# Altium schematic sheet Main_NTC_Extension_5fach.SchDoc
size A4; SheetNumber: 1; SheetTotal: 1
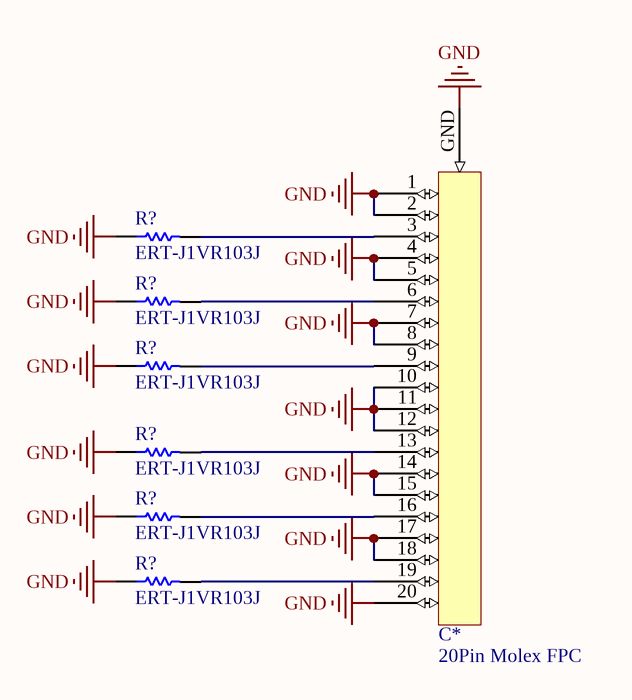
[diagram p0: Main_NTC_Extension_5fach.SchDoc]

## Parts
(Parts that share a designator on the sheet are numbered #1, #2 ... from top to bottom, then left to right.)
C*  20Pin Molex FPC  [Molex 20 Pin FPC]
R?#1  ERT-J1VR103J  [RESC1608X90X30ML15T20]
R?#2  ERT-J1VR103J  [RESC1608X90X30ML15T20]
R?#3  ERT-J1VR103J  [RESC1608X90X30ML15T20]
R?#4  ERT-J1VR103J  [RESC1608X90X30ML15T20]
R?#5  ERT-J1VR103J  [RESC1608X90X30ML15T20]
R?#6  ERT-J1VR103J  [RESC1608X90X30ML15T20]

## Nets
GND: C*.1 C*.2 C*.4 C*.5 C*.7 C*.8 C*.10 C*.11 C*.12 C*.14 C*.15 C*.17 C*.18 C*.20 C*.GND R?#1.1 R?#2.1 R?#3.1 R?#4.1 R?#5.1 R?#6.1
NetC*_3: C*.3 R?#1.2
NetC*_6: C*.6 R?#2.2
NetC*_9: C*.9 R?#3.2
NetC*_13: C*.13 R?#4.2
NetC*_16: C*.16 R?#5.2
NetC*_19: C*.19 R?#6.2

## Library data of the parts
C* = 20Pin Molex FPC: Flex PCB part for the Molex 20pin FCC
R?#1-R?#6 = CMP-2000-00869-1: Manufacturer: Panasonic; Part Number: ERT-J1VR103J